# Altium schematic sheet ESP01S麦轮.SchDoc
size A3; SheetNumber: 1; SheetTotal: 1
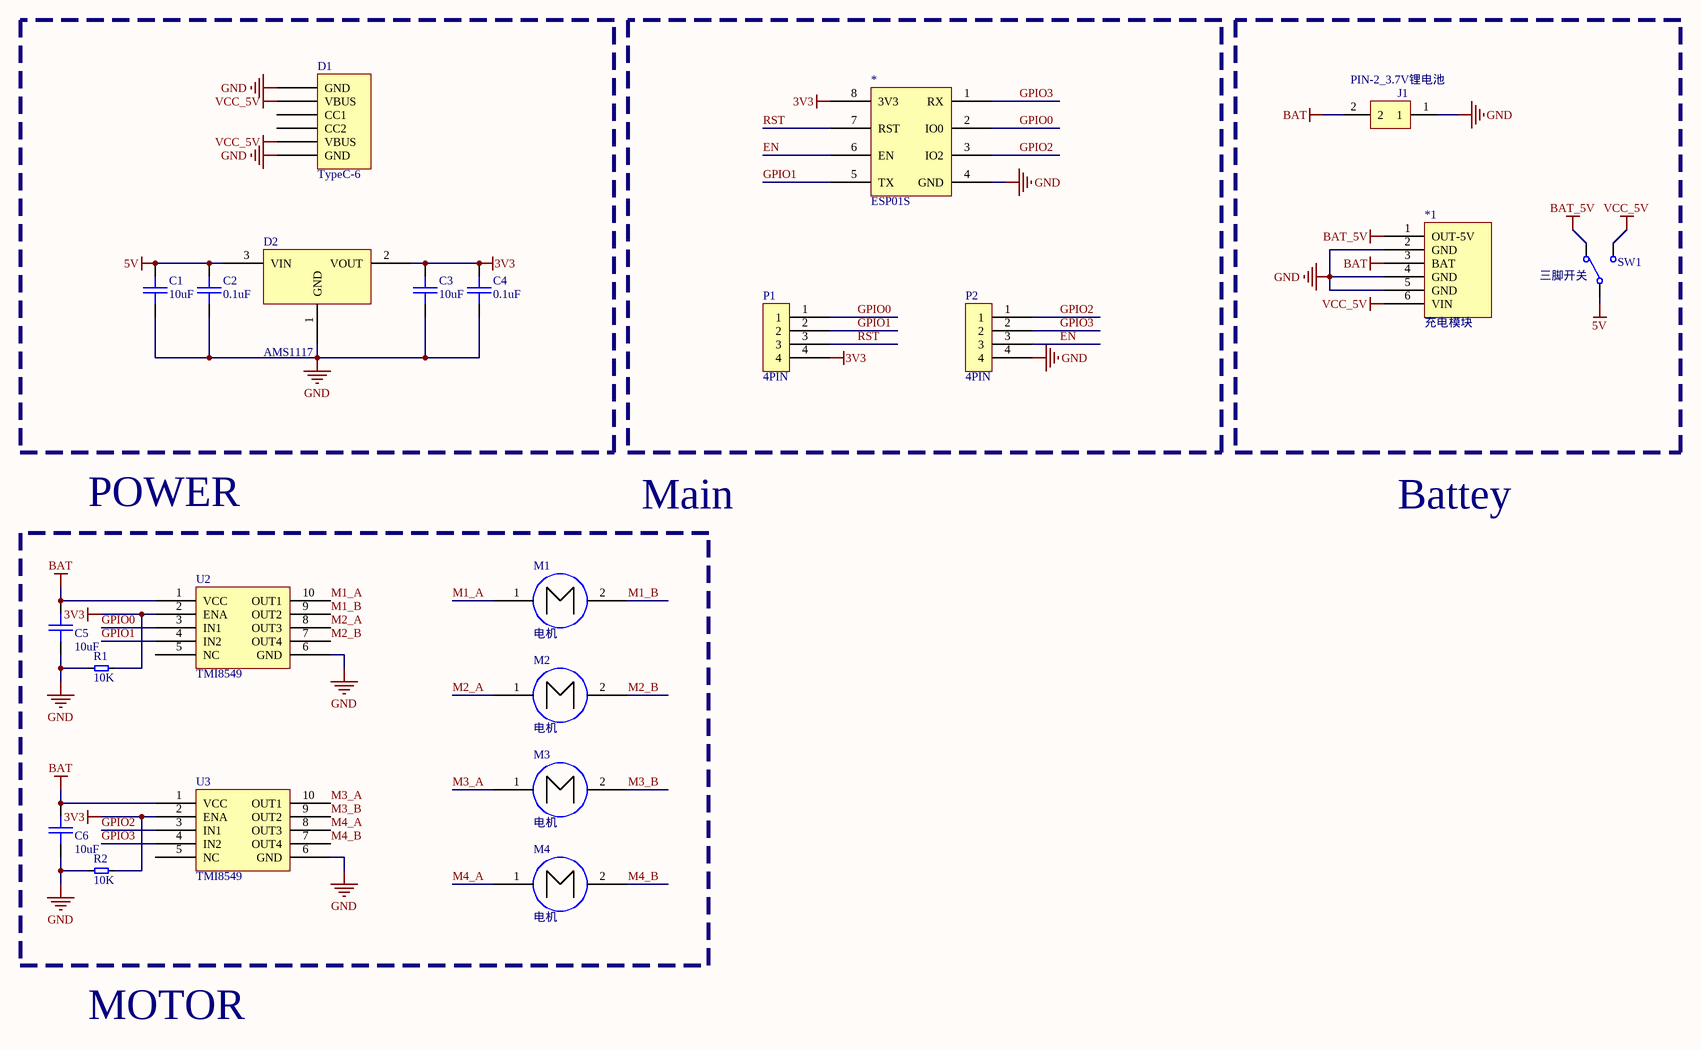
[diagram p0: ESP01S麦轮.SchDoc]

## Parts
*  ESP01S  [2*4排针]
*1  充电模块  [1*6排针]
C1  10uF  [0603C]
C2  0.1uF  [0603C]
C3  10uF  [0603C]
C4  0.1uF  [0603C]
C5  10uF  [0603C]
C6  10uF  [0603C]
D1  TypeC-6  [TypeC-6]
D2  AMS1117  [AMS1117]
J1  PIN-2_3.7V锂电池  [XH2.54_2PIN]
M1  电机  [电机触点]
M2  电机  [电机触点]
M3  电机  [电机触点]
M4  电机  [电机触点]
P1  4PIN  [1*4排针]
P2  4PIN  [1*4排针]
R1  10K  [0603C]
R2  10K  [0603C]
SW1  三脚开关  [1*3排针]
U2  TMI8549  [SOP-10]
U3  TMI8549  [SOP-10]

## Nets
3V3: *.8(3V3) C3.1 C4.1 D2.2(VOUT) P1.4 R1.2 R2.2 U2.2(ENA) U3.2(ENA)
5V: C1.1 C2.1 D2.3(VIN) SW1.2
BAT: *1.3(BAT) C5.1 C6.1 J1.2 U2.1(VCC) U3.1(VCC)
BAT_5V: *1.1(OUT-5V) SW1.1
GND: *.4(GND) *1.2(GND) *1.4(GND) *1.5(GND) C1.2 C2.2 C3.2 C4.2 C5.2 C6.2 D1.A12(GND) D1.B12(GND) D2.1(GND) J1.1 P2.4 R1.1 R2.1 U2.6(GND) U3.6(GND)
VCC_5V: *1.6(VIN) D1.A9(VBUS) D1.B9(VBUS) SW1.3
EN: *.6(EN) P2.3
GPIO0: *.2(IO0) P1.1 U2.3(IN1)
GPIO1: *.5(TX) P1.2 U2.4(IN2)
GPIO2: *.3(IO2) P2.1 U3.3(IN1)
GPIO3: *.1(RX) P2.2 U3.4(IN2)
M1_A: M1.1 U2.10(OUT1)
M1_B: M1.2 U2.9(OUT2)
M2_A: M2.1 U2.8(OUT3)
M2_B: M2.2 U2.7(OUT4)
M3_A: M3.1 U3.10(OUT1)
M3_B: M3.2 U3.9(OUT2)
M4_A: M4.1 U3.8(OUT3)
M4_B: M4.2 U3.7(OUT4)
RST: *.7(RST) P1.3

Not connected (* = marked no-connect by the designer): D1 A5(CC1) B5(CC2); U2 5(NC); U3 5(NC)

## Notes on the sheet
- POWER
- Main
- Battey
- MOTOR

## Library data of the parts
C1-C6 = CAP
J1 = PIN-2
R1 R2 = RES
SW1 = SWITCH-NKK-M201x: Switch
U2 U3 = TMI8529